# EAGLE schematic wifi-expansion (EAGLE 6.4)

## Sheet 1 of 2
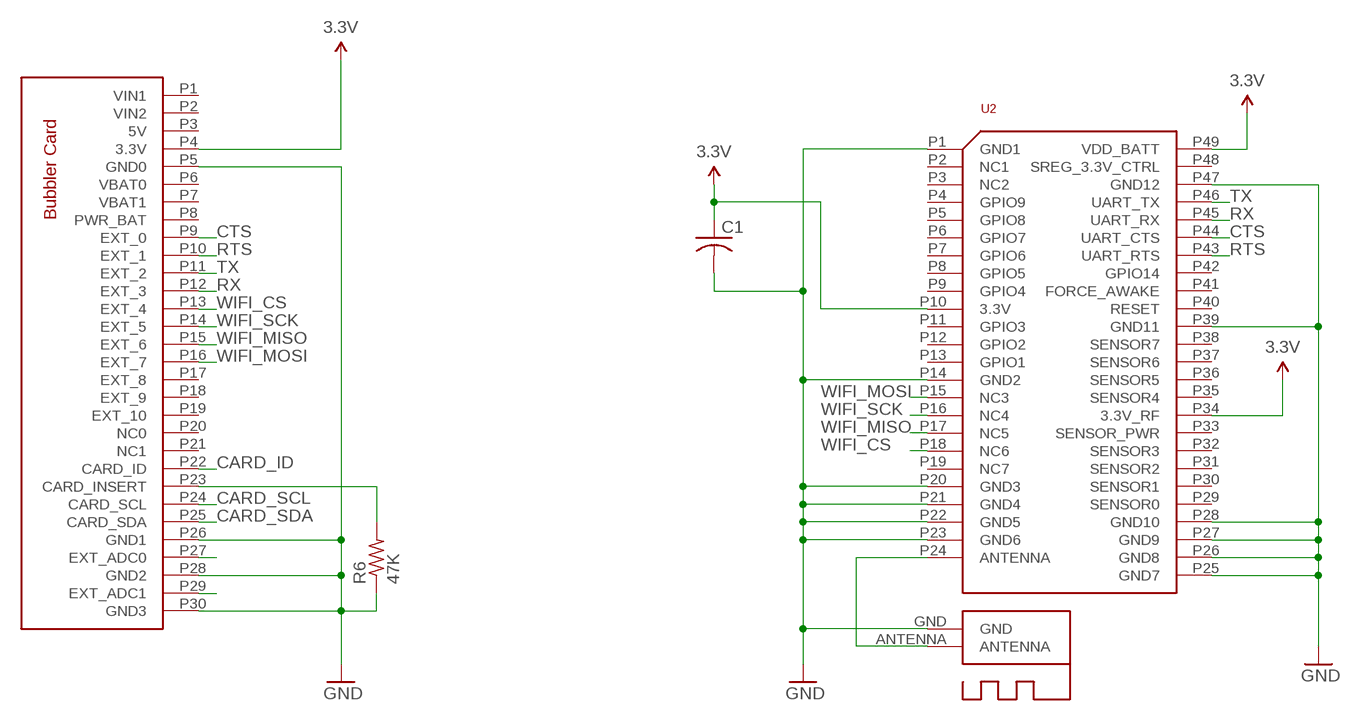
[diagram p0: schematic, sheet 1]

### Parts
C1  C-USC1206  [C1206]
R6  47K  R-US_R0402  [R0402]
U2  WIFI-RN-171  [WIFI-RN-171]
U$2  BUBBLER_CARD  [CONNECTOR-JAE-TX24-30M]
U$3  ANTENNA-RN-171  [RN-171-ANTENNA]

### Nets
3.3V: C1.1 U2.P10(3.3V) U2.P34(3.3V_RF) U2.P49(VDD_BATT) U$2.P4(3.3V) ; supply symbol labelled @3.3V ; also sheet 2
CARD_ID: U$2.P22(CARD_ID) ; also sheet 2
CARD_SCL: U$2.P24(CARD_SCL) ; also sheet 2
CARD_SDA: U$2.P25(CARD_SDA) ; also sheet 2
CTS: U2.P44(UART_CTS) U$2.P9(EXT_0)
GND: C1.2 R6.1 U2.P1(GND1) U2.P14(GND2) U2.P20(GND3) U2.P21(GND4) U2.P22(GND5) U2.P23(GND6) U2.P25(GND7) U2.P26(GND8) U2.P27(GND9) U2.P28(GND10) U2.P39(GND11) U2.P47(GND12) U$2.P5(GND0) U$2.P26(GND1) U$2.P28(GND2) U$2.P30(GND3) U$3.GND ; supply symbol labelled @GND ; also sheet 2
N$1: U$2.P29(EXT_ADC1)
N$2: U$2.P27(EXT_ADC0)
N$7: R6.2 U$2.P23(CARD_INSERT)
N$9: U2.P24(ANTENNA) U$3.ANTENNA
RTS: U2.P43(UART_RTS) U$2.P10(EXT_1)
RX: U2.P45(UART_RX) U$2.P12(EXT_3)
TX: U2.P46(UART_TX) U$2.P11(EXT_2)
WIFI_CS: U2.P18(NC6) U$2.P13(EXT_4)
WIFI_MISO: U2.P17(NC5) U$2.P15(EXT_6)
WIFI_MOSI: U2.P15(NC3) U$2.P16(EXT_7)
WIFI_SCK: U2.P16(NC4) U$2.P14(EXT_5)
Unconnected: U2.P2(NC1) U2.P3(NC2) U2.P4(GPIO9) U2.P5(GPIO8) U2.P6(GPIO7) U2.P7(GPIO6) U2.P8(GPIO5) U2.P9(GPIO4) U2.P11(GPIO3) U2.P12(GPIO2) U2.P13(GPIO1) U2.P19(NC7) U2.P29(SENSOR0) U2.P30(SENSOR1) U2.P31(SENSOR2) U2.P32(SENSOR3) U2.P33(SENSOR_PWR) U2.P35(SENSOR4) U2.P36(SENSOR5) U2.P37(SENSOR6) U2.P38(SENSOR7) U2.P40(RESET) U2.P41(FORCE_AWAKE) U2.P42(GPIO14) U2.P48(SREG_3.3V_CTRL) U$2.P1(VIN1) U$2.P2(VIN2) U$2.P3(5V) U$2.P6(VBAT0) U$2.P7(VBAT1) U$2.P8(PWR_BAT) U$2.P17(EXT_8) U$2.P18(EXT_9) U$2.P19(EXT_10) U$2.P20(NC0) U$2.P21(NC1)

## Sheet 2 of 2
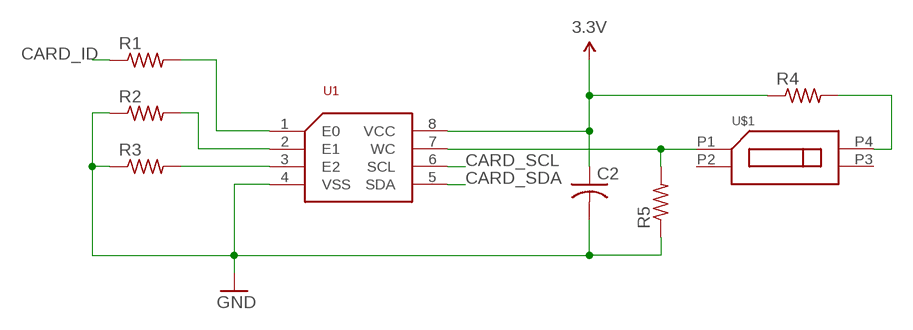
[diagram p1: schematic, sheet 2]

### Parts
C2  C-USC0402  [C0402]
R1  R-US_R0402  [R0402]
R2  R-US_R0402  [R0402]
R3  R-US_R0402  [R0402]
R4  R-US_R0402  [R0402]
R5  R-US_R0402  [R0402]
U1  EEPROM-ST-M24C64  [TSSOP8]
U$1  SWITCH-DIP-GDH-02  [SWITCH-DIP-GDH-02]

### Nets
3.3V: C2.1 R4.1 U1.8(VCC) ; supply symbol labelled @3.3V ; also sheet 1
CARD_ID: R1.1 ; also sheet 1
CARD_SCL: U1.6(SCL) ; also sheet 1
CARD_SDA: U1.5(SDA) ; also sheet 1
GND: C2.2 R2.1 R3.1 R5.1 U1.4(VSS) ; supply symbol labelled @GND ; also sheet 1
N$3: R3.2 U1.3(E2)
N$4: R2.2 U1.2(E1)
N$5: R1.2 U1.1(E0)
N$6: R5.2 U1.7(WC) U$1.P1(SW0_0)
N$8: R4.2 U$1.P4(SW0_1)
Unconnected: U$1.P2(SW1_0) U$1.P3(SW1_1)

## Library data of the parts
C1 C2 = rcl:C-US: CAPACITOR, American symbol
R1-R6 = rcl:R-US_: RESISTOR, American symbol
U1 = Pygmy:EEPROM-ST-M24C64
U2 = Pygmy:WIFI-RN-171
U$1 = Pygmy:SWITCH-DIP-GDH-02
U$2 = Pygmy:BUBBLER_CARD
U$3 = Pygmy:ANTENNA-RN-171